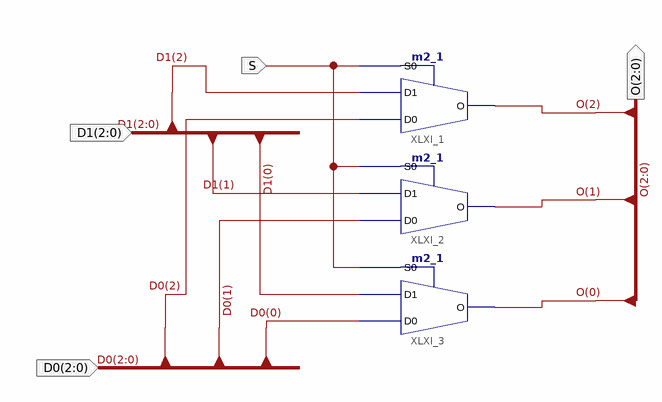
[diagram p0: schematic sheet 1]
// Xilinx ISE schematic mux3bit2to1.sch (spartan3e) as structural Verilog: 3 symbols, 4 ports
module mux3bit2to1 (
  input  S,
  input  [2:0] D0,
  input  [2:0] D1,
  output [2:0] O
);

  m2_1 XLXI_1 (.D0(D0[2]), .D1(D1[2]), .S0(S), .O(O[2]));
  m2_1 XLXI_2 (.D0(D0[1]), .D1(D1[1]), .S0(S), .O(O[1]));
  m2_1 XLXI_3 (.D0(D0[0]), .D1(D1[0]), .S0(S), .O(O[0]));
endmodule
